# Altium schematic sheet Micromouse.SchDoc
size A1; SheetNumber: 1; SheetTotal: 1
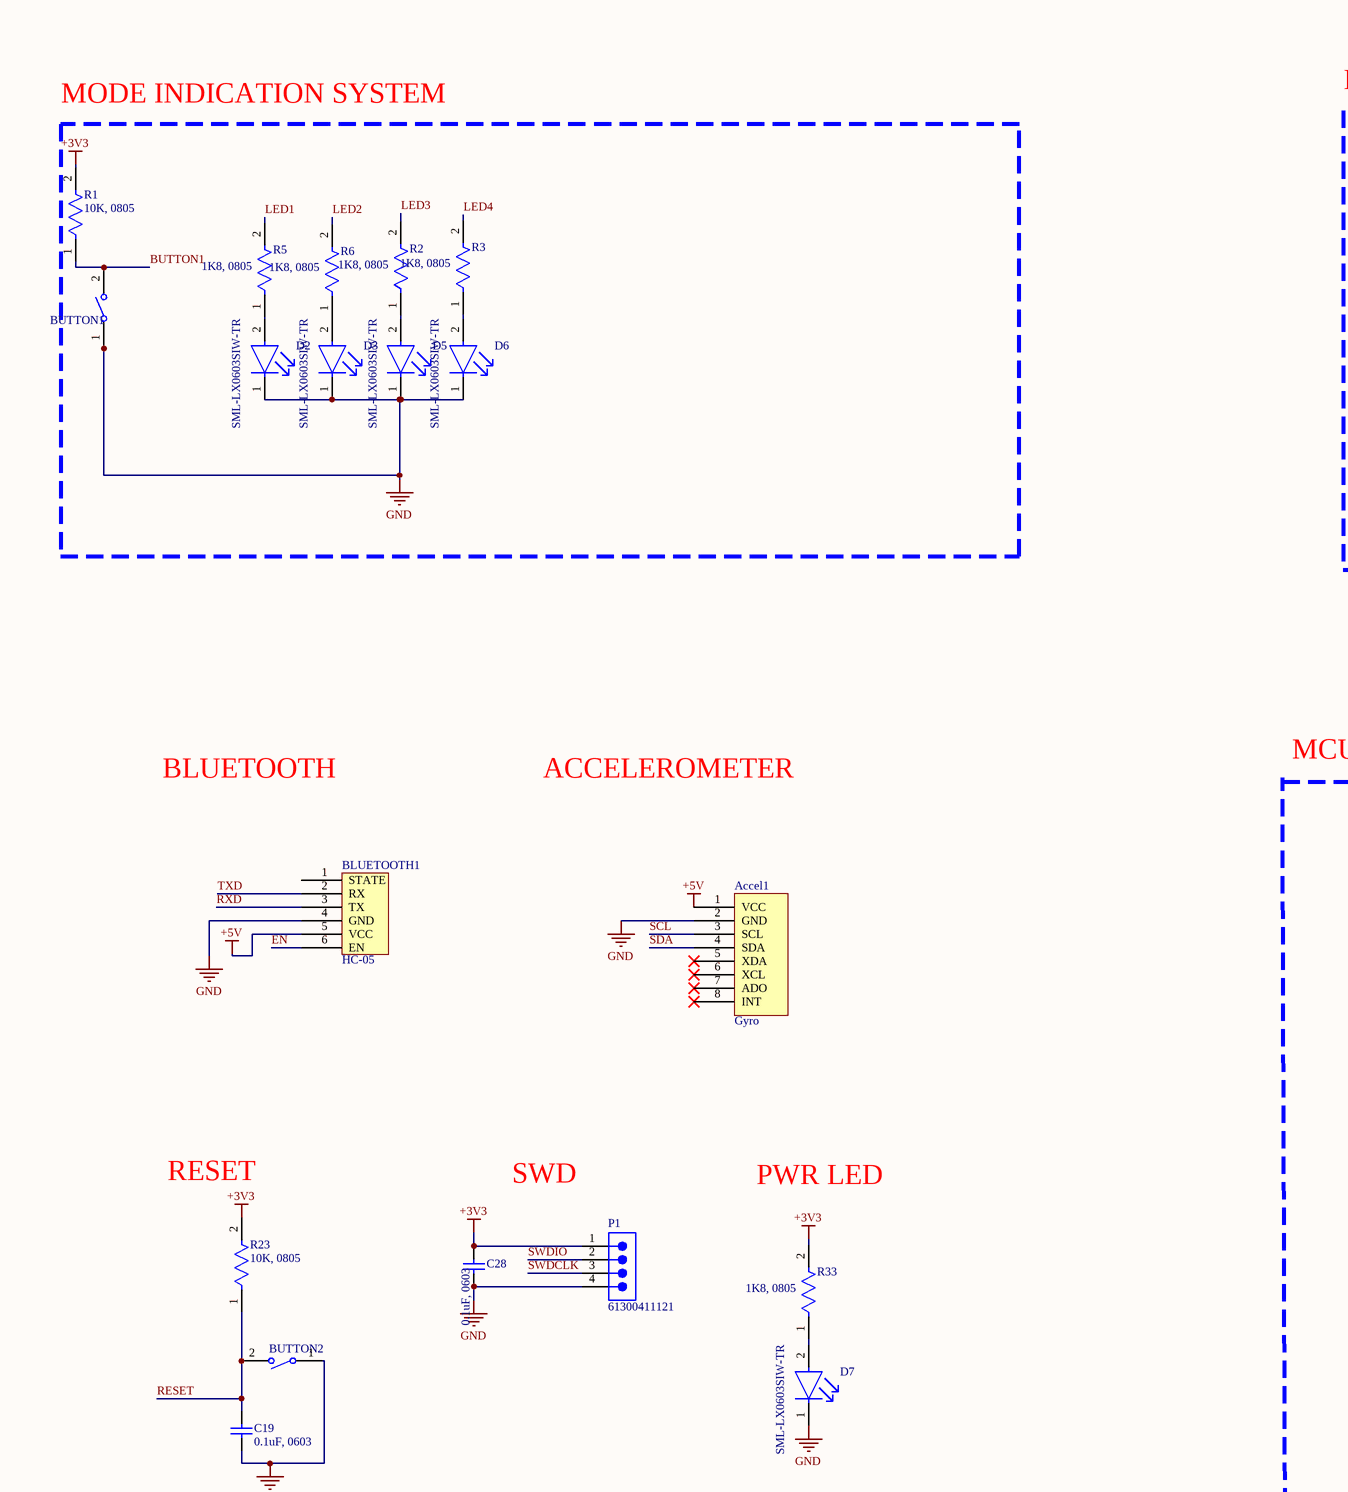
[diagram p0: Micromouse.SchDoc, top left]
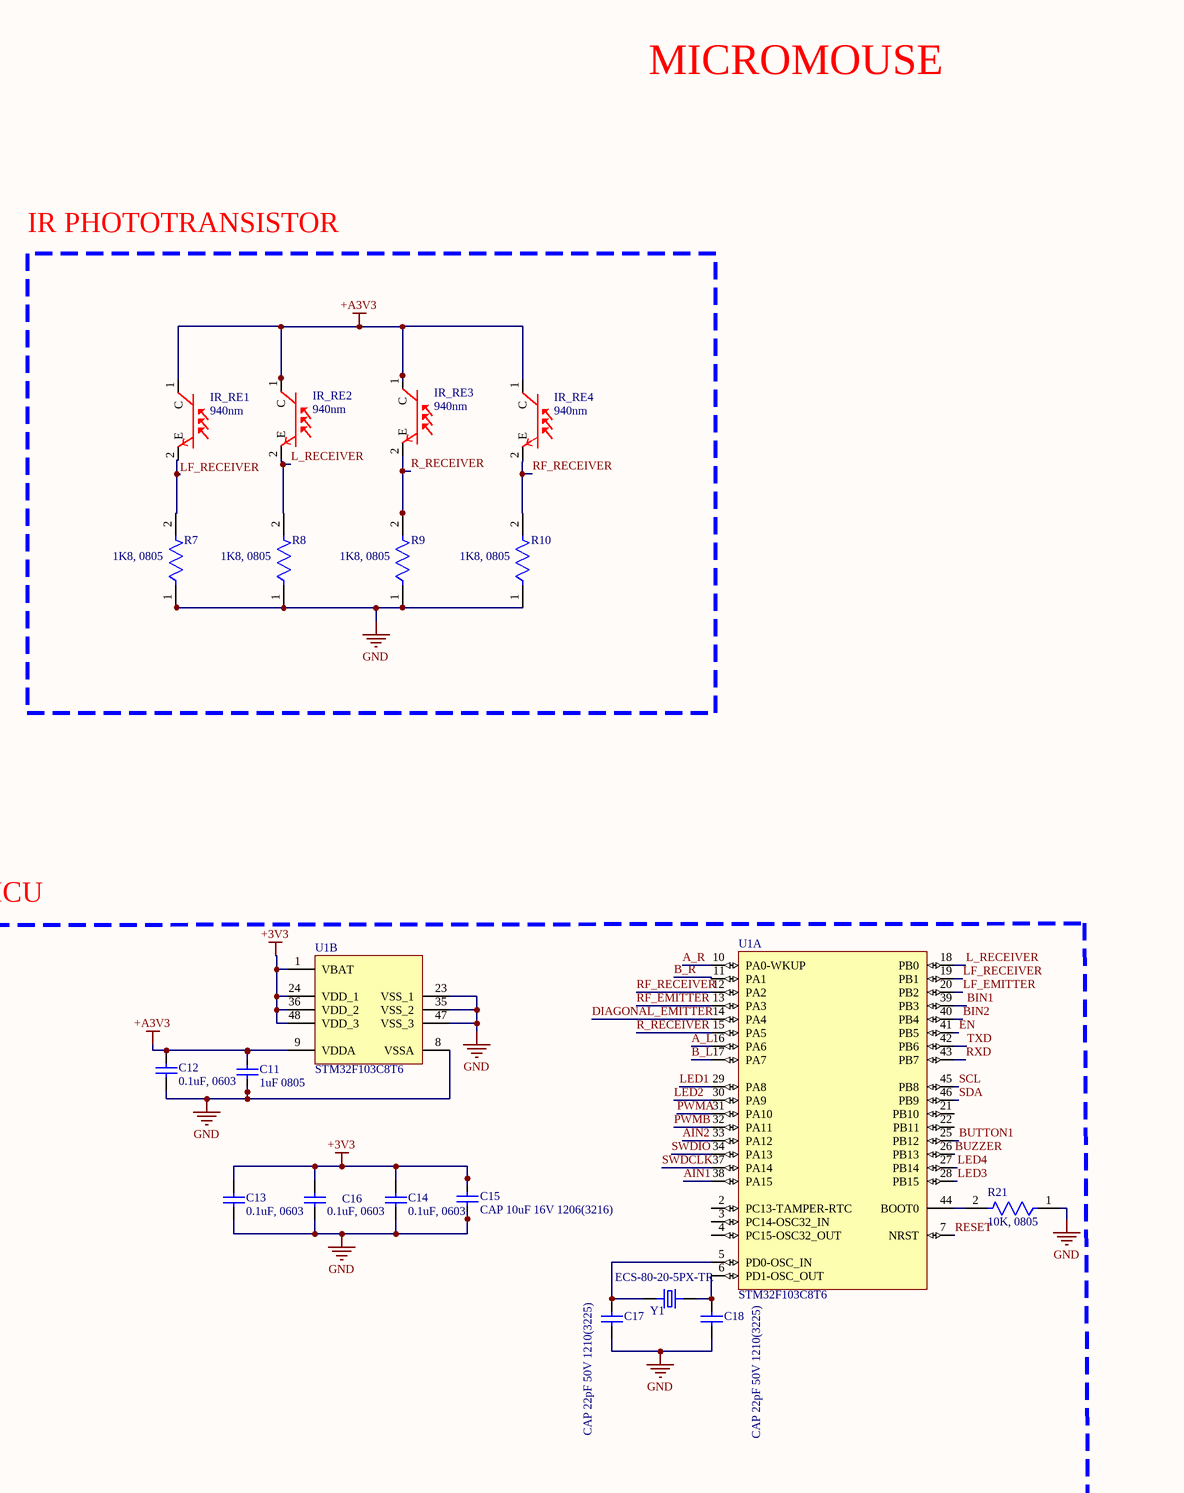
[diagram p1: Micromouse.SchDoc, top middle]
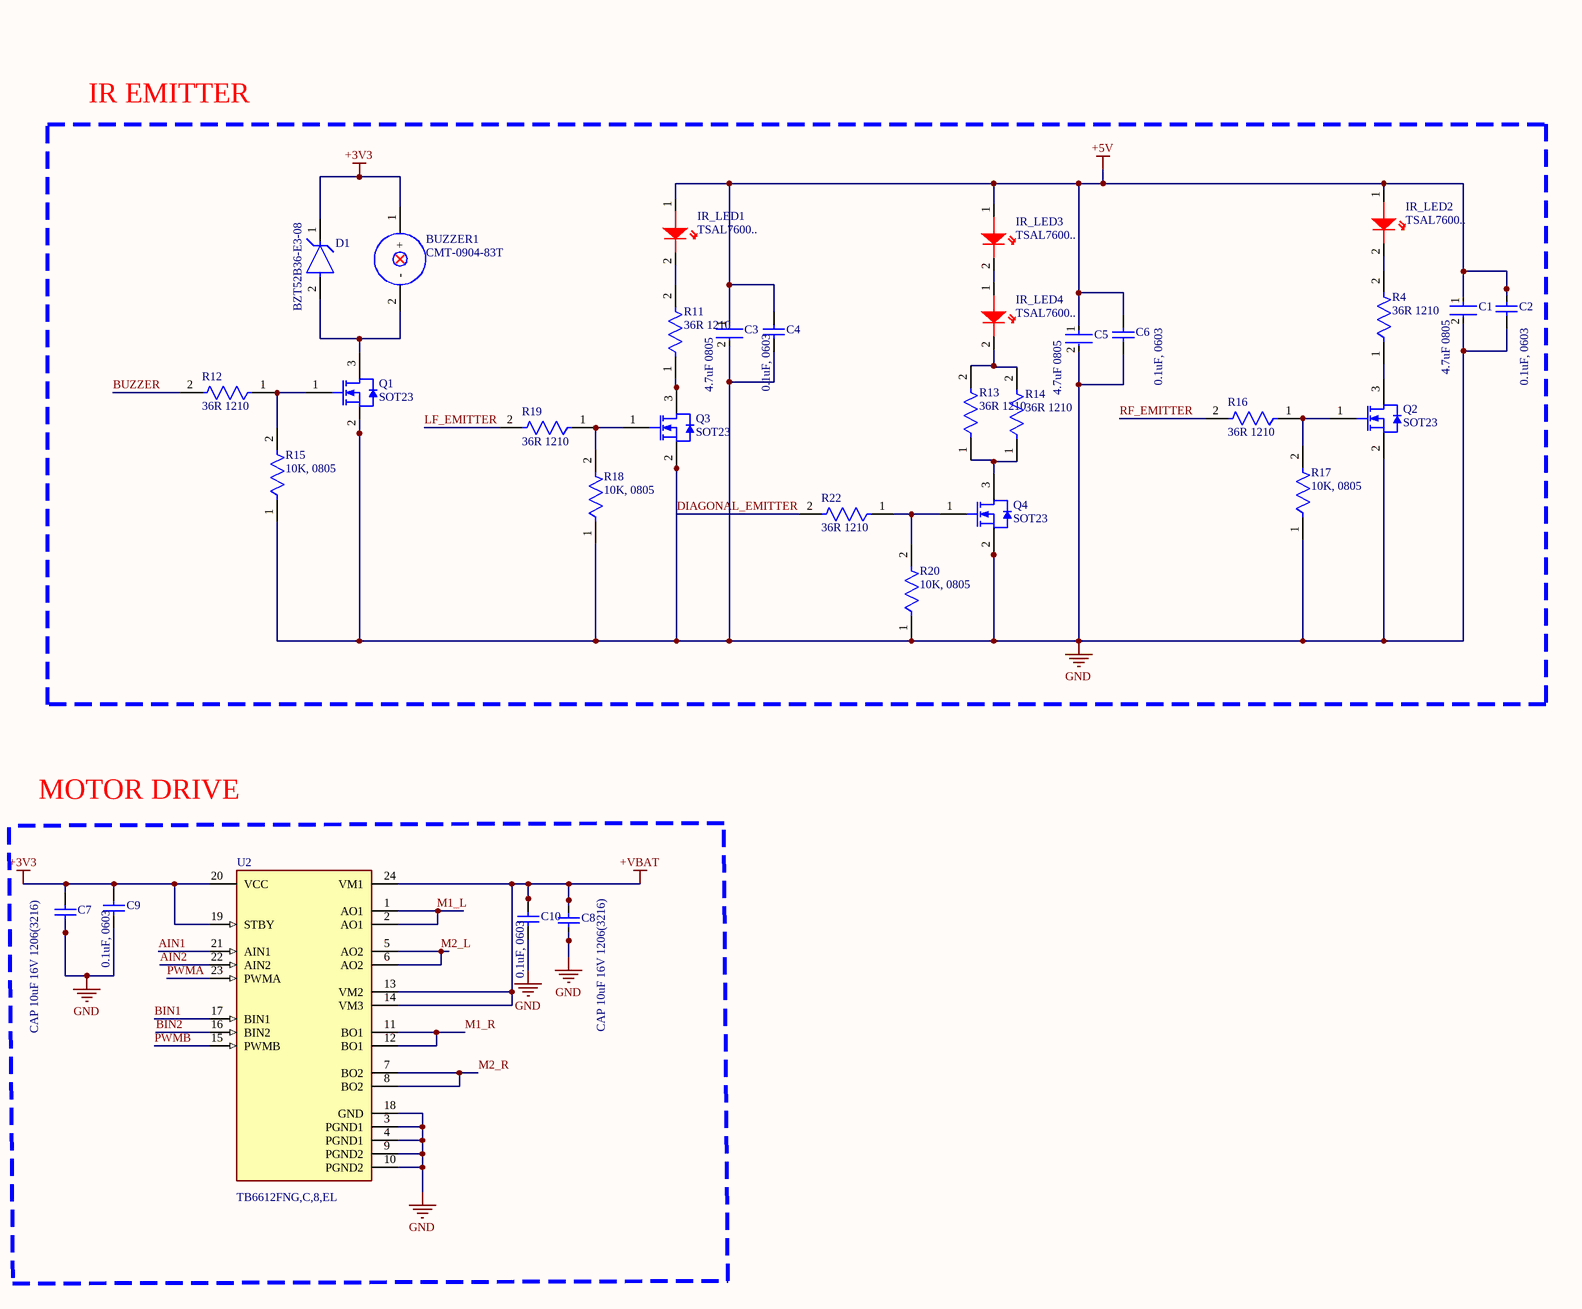
[diagram p2: Micromouse.SchDoc, top right]
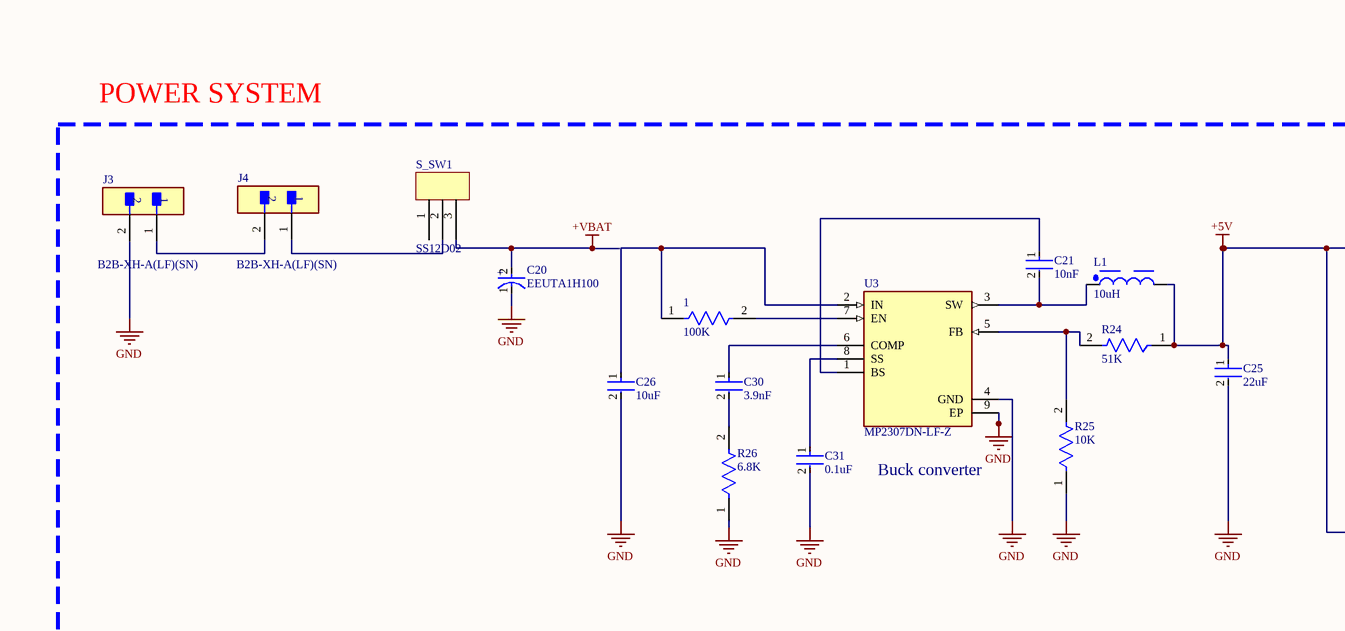
[diagram p3: Micromouse.SchDoc, bottom left]
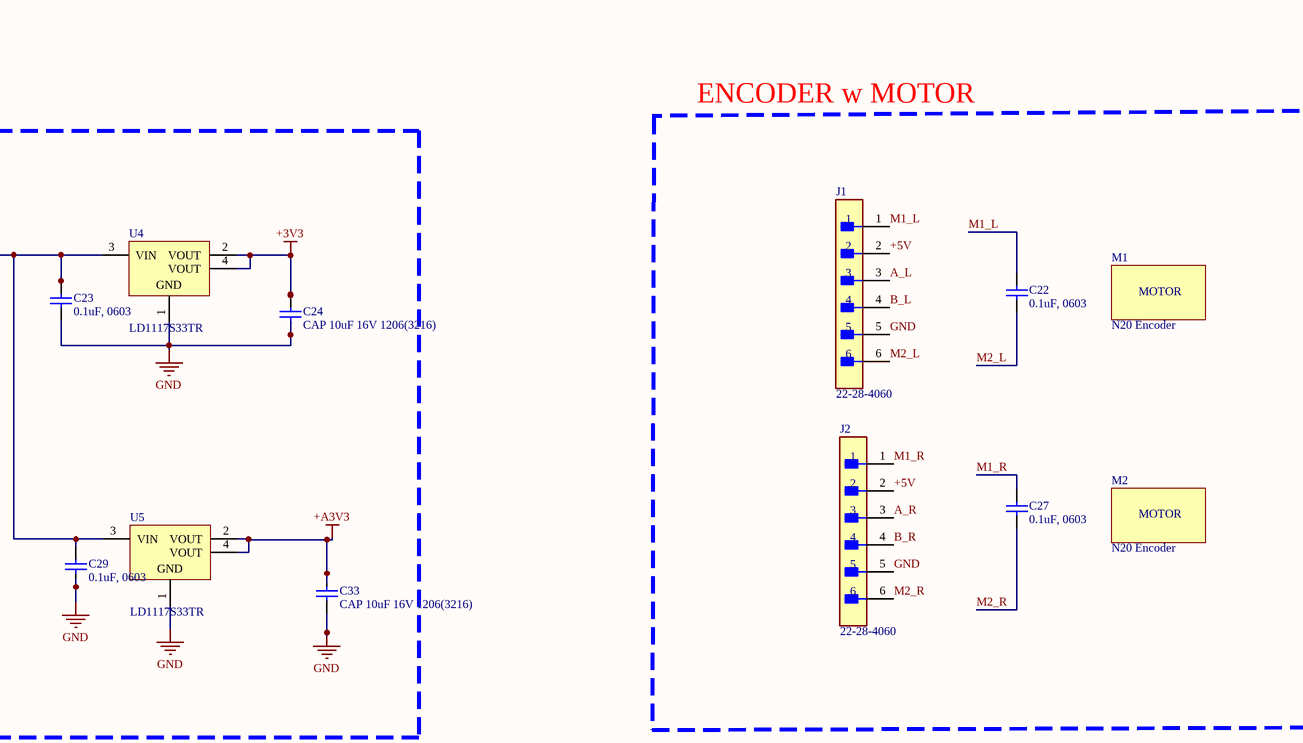
[diagram p4: Micromouse.SchDoc, bottom middle]
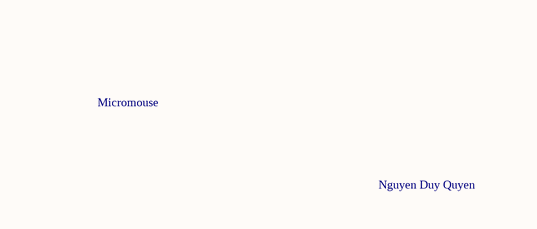
[diagram p5: Micromouse.SchDoc, bottom right]

## Parts
1  100K  [FP-CRCW0805-e3-IPC_B]
Accel1  Gyro  [Gyro]
BLUETOOTH1  HC-05  [HC-05]
BUTTON1  (no value)  [TECO-FSMSMTR_V]
BUTTON2  (no value)  [TECO-FSMSMTR_V]
BUZZER1  CMT-0904-83T  [BUZZER]
C1  4.7uF 0805  [FP-CC0805-0_85-MFG]
C2  0.1uF, 0603  [CAPC1608X92X38NL15T08]
C3  4.7uF 0805  [FP-CC0805-0_85-MFG]
C4  0.1uF, 0603  [CAPC1608X92X38NL15T08]
C5  4.7uF 0805  [FP-CC0805-0_85-MFG]
C6  0.1uF, 0603  [CAPC1608X92X38NL15T08]
C7  CAP 10uF 16V 1206(3216)  [CAPC1206(3216)190_L]
C8  CAP 10uF 16V 1206(3216)  [CAPC1206(3216)190_L]
C9  0.1uF, 0603  [CAPC1608X92X38NL15T08]
C10  0.1uF, 0603  [CAPC1608X92X38NL15T08]
C11  1uF 0805  [CAPC2013X145X50NL20T20]
C12  0.1uF, 0603  [CAPC1608X92X38NL15T08]
C13  0.1uF, 0603  [CAPC1608X92X38NL15T08]
C14  0.1uF, 0603  [CAPC1608X92X38NL15T08]
C15  CAP 10uF 16V 1206(3216)  [CAPC1206(3216)190_L]
C16  0.1uF, 0603  [CAPC1608X92X38NL15T08]
C17  CAP 22pF 50V 1210(3225)  [CAPC1210(3225)100_N]
C18  CAP 22pF 50V 1210(3225)  [CAPC1210(3225)100_N]
C19  0.1uF, 0603  [CAPC1608X92X38NL15T08]
C20  EEUTA1H100  [FP-RAD-TH-D_8_0_5-L_11_5-MFG]
C21  10nF  [FP-C1206C-EB-MFG]
C22  0.1uF, 0603  [CAPC1608X92X38NL15T08]
C23  0.1uF, 0603  [CAPC1608X92X38NL15T08]
C24  CAP 10uF 16V 1206(3216)  [CAPC1206(3216)190_L]
C25  22uF  [FP-C1206C-EB-MFG]
C26  10uF  [FP-C1206C-EB-MFG]
C27  0.1uF, 0603  [CAPC1608X92X38NL15T08]
C28  0.1uF, 0603  [CAPC1608X92X38NL15T08]
C29  0.1uF, 0603  [CAPC1608X92X38NL15T08]
C30  3.9nF  [FP-C1206C-EB-MFG]
C31  0.1uF  [FP-C1206C-EB-MFG]
C33  CAP 10uF 16V 1206(3216)  [CAPC1206(3216)190_L]
D1  BZT52B36-E3-08  [FP-S8-V-3910_01-001-IPC_C]
D2  SML-LX0603SIW-TR  [FP-SML-LX0603SIW-TR-MFG]
D3  SML-LX0603SIW-TR  [FP-SML-LX0603SIW-TR-MFG]
D5  SML-LX0603SIW-TR  [FP-SML-LX0603SIW-TR-MFG]
D6  SML-LX0603SIW-TR  [FP-SML-LX0603SIW-TR-MFG]
D7  SML-LX0603SIW-TR  [FP-SML-LX0603SIW-TR-MFG]
IR_LED1  TSAL7600..  [IR LED]
IR_LED2  TSAL7600..  [IR LED]
IR_LED3  TSAL7600..  [IR LED]
IR_LED4  TSAL7600..  [IR LED]
IR_RE1  940nm  [IR_RE]
IR_RE2  940nm  [IR_RE]
IR_RE3  940nm  [IR_RE]
IR_RE4  940nm  [IR_RE]
J1  22-28-4060  [FP-22-28-4060-MFG]
J2  22-28-4060  [FP-22-28-4060-MFG]
J3  B2B-XH-A(LF)(SN)  [FP-B2B-XH-A_LF_SN-MFG]
J4  B2B-XH-A(LF)(SN)  [FP-B2B-XH-A_LF_SN-MFG]
L1  10uH  [WE-TPC_5818]
M1  N20 Encoder  [N20 Encoder]
M2  N20 Encoder  [N20 Encoder]
P1  61300411121  [61300411121]
Q1  SOT23  [FAIR-SSOT3L-3_V]
Q2  SOT23  [FAIR-SSOT3L-3_V]
Q3  SOT23  [FAIR-SSOT3L-3_V]
Q4  SOT23  [FAIR-SSOT3L-3_V]
R1  10K, 0805  [FP-CRGP0805-IPC_C]
R2  1K8, 0805  [FP-CRCW0805-e3-IPC_A]
R3  1K8, 0805  [FP-CRCW0805-e3-IPC_A]
R4  36R 1210  [FP-ESR25-IPC_A]
R5  1K8, 0805  [FP-CRCW0805-e3-IPC_A]
R6  1K8, 0805  [FP-CRCW0805-e3-IPC_A]
R7  1K8, 0805  [FP-CRCW0805-e3-IPC_A]
R8  1K8, 0805  [FP-CRCW0805-e3-IPC_A]
R9  1K8, 0805  [FP-CRCW0805-e3-IPC_A]
R10  1K8, 0805  [FP-CRCW0805-e3-IPC_A]
R11  36R 1210  [FP-ESR25-IPC_A]
R12  36R 1210  [FP-ESR25-IPC_A]
R13  36R 1210  [FP-ESR25-IPC_A]
R14  36R 1210  [FP-ESR25-IPC_A]
R15  10K, 0805  [FP-CRGP0805-IPC_C]
R16  36R 1210  [FP-ESR25-IPC_A]
R17  10K, 0805  [FP-CRGP0805-IPC_C]
R18  10K, 0805  [FP-CRGP0805-IPC_C]
R19  36R 1210  [FP-ESR25-IPC_A]
R20  10K, 0805  [FP-CRGP0805-IPC_C]
R21  10K, 0805  [FP-CRGP0805-IPC_C]
R22  36R 1210  [FP-ESR25-IPC_A]
R23  10K, 0805  [FP-CRGP0805-IPC_C]
R24  51K  [FP-CRCW0805-e3-IPC_B]
R25  10K  [FP-CRCW0805-e3-IPC_B]
R26  6.8K  [FP-CRCW0805-e3-IPC_B]
R33  1K8, 0805  [FP-CRCW0805-e3-IPC_A]
S_SW1  SS12D02  [S_SW?]
U1  STM32F103C8T6  [STM-LQFP48_L]  (parts A,B of 2)
U2  TB6612FNG,C,8,EL  [FP-SSOP24-P-300-0_65A-IPC_A]
U3  MP2307DN-LF-Z  [SOIC127P600X170-9N]
U4  LD1117S33TR  [SOT-223_L]
U5  LD1117S33TR  [SOT-223_L]
Y1  ECS-80-20-5PX-TR  [XTAL_ECS-80-20-5PX-TR]

## Blocks framed on the sheet
MODE INDICATION SYSTEM: BUTTON1 D2 D3 D5 D6 R1-R3 R5 R6
IR PHOTOTRANSISTOR: IR_RE1-IR_RE4 R7-R10
IR EMITTER: BUZZER1 C1-C6 D1 IR_LED1-IR_LED4 Q1-Q4 R4 R11-R20 R22
MOTOR DRIVE: C7-C10 U2
POWER SYSTEM: 1 C20 C21 C23-C26 C29-C31 C33 J3 J4 L1 R24-R26 S_SW1 U3-U5
ENCODER w MOTOR: C22 C27 J1 J2 M1 M2

## Nets
+3V3: BUZZER1.1(+) C7.2 C9.2 C13.2 C14.2 C15.2 C16.2 C24.2 C28.2 D1.1(C) P1.1 R1.2 R23.2 R33.2 U1.1(VBAT) U1.24(VDD_1) U1.36(VDD_2) U1.48(VDD_3) U2.19(STBY) U2.20(VCC) U4.2(VOUT) U4.4(VOUT)
+5V: Accel1.1(VCC) BLUETOOTH1.5(VCC) C1.1 C2.2 C3.1 C4.2 C5.1 C6.2 C23.2 C25.1 C29.2 IR_LED1.1(A) IR_LED2.1(A) IR_LED3.1(A) J1.2 J2.2 L1.2 R24.1 U4.3(VIN) U5.3(VIN)
+A3V3: C11.2 C12.2 C33.2 IR_RE1.1(C) IR_RE2.1(C) IR_RE3.1(C) IR_RE4.1(C) U1.9(VDDA) U5.2(VOUT) U5.4(VOUT)
+VBAT: C8.2 C10.2 C20.2(A) S_SW1.3 U2.13(VM2) U2.14(VM3) U2.24(VM1)
DIAGONAL_EMITTER: Accel1.2(GND) BLUETOOTH1.4(GND) BUTTON1.1 BUTTON2.1 C1.2 C2.1 C3.2 C4.1 C5.2 C6.1 C7.1 C8.1 C9.1 C10.1 C11.1 C12.1 C13.1 C14.1 C15.1 C16.1 C17.1 C18.1 C19.1 C20.1(C) C23.1 C24.1 C25.2 C26.2 C28.1 C29.1 C31.2 C33.1 D2.1(C) D3.1(C) D5.1(C) D6.1(C) D7.1(C) J1.5 J2.5 J3.2 P1.4 Q1.2(S) Q2.2(S) Q3.2(S) Q4.2(S) R7.1 R8.1 R9.1 R10.1 R15.1 R17.1 R18.1 R20.1 R21.1 R22.2 R25.1 R26.1 U1.8(VSSA) U1.14(PA4) U1.23(VSS_1) U1.35(VSS_2) U1.47(VSS_3) U2.3(PGND1) U2.4(PGND1) U2.9(PGND2) U2.10(PGND2) U2.18(GND) U3.4(GND) U3.9(EP) U4.1(GND) U5.1(GND)  [also labelled GND]
A_L: J1.3 U1.16(PA6)
A_R: J2.3 U1.10(PA0-WKUP)
AIN1: U1.38(PA15) U2.21(AIN1)
AIN2: U1.33(PA12) U2.22(AIN2)
B_L: J1.4 U1.17(PA7)
B_R: J2.4 U1.11(PA1)
BIN1: U1.39(PB3) U2.17(BIN1)
BIN2: U1.40(PB4) U2.16(BIN2)
BUTTON1: BUTTON1.2 R1.1 U1.25(PB12)
BUZZER: R12.2 U1.26(PB13)
EN: BLUETOOTH1.6(EN) U1.41(PB5)
L_RECEIVER: IR_RE2.2(E) R8.2 U1.18(PB0)
LED1: R5.2 U1.29(PA8)
LED2: R6.2 U1.30(PA9)
LED3: R2.2 U1.28(PB15)
LED4: R3.2 U1.27(PB14)
LF_EMITTER: R19.2 U1.20(PB2)
LF_RECEIVER: IR_RE1.2(E) R7.2 U1.19(PB1)
M1_L: C22.2 J1.1 U2.1(AO1) U2.2(AO1)
M1_R: C27.2 J2.1 U2.11(BO1) U2.12(BO1)
M2_L: C22.1 J1.6 U2.5(AO2) U2.6(AO2)
M2_R: C27.1 J2.6 U2.7(BO2) U2.8(BO2)
PWMA: U1.31(PA10) U2.23(PWMA)
PWMB: U1.32(PA11) U2.15(PWMB)
R_RECEIVER: IR_RE3.2(E) R9.2 U1.15(PA5)
RESET: BUTTON2.2 C19.2 R23.1 U1.7(NRST)
RF_EMITTER: R16.2 U1.13(PA3)
RF_RECEIVER: IR_RE4.2(E) R10.2 U1.12(PA2)
RXD: BLUETOOTH1.3(TX) U1.43(PB7)
SCL: Accel1.3(SCL) U1.45(PB8)
SDA: Accel1.4(SDA) U1.46(PB9)
SWDCLK: P1.3 U1.37(PA14)
SWDIO: P1.2 U1.34(PA13)
TXD: BLUETOOTH1.2(RX) U1.42(PB6)
Net1_1: 1.1 C26.1 U3.2(IN)
Net1_2: 1.2 U3.7(EN)
NetBUZZER1_2: BUZZER1.2(-) D1.2(A) Q1.3(D)
NetC17_2: C17.2 U1.5(PD0-OSC_IN) Y1.1
NetC18_2: C18.2 U1.6(PD1-OSC_OUT) Y1.2
NetC21_1: C21.1 U3.1(BS)
NetC21_2: C21.2 L1.1 U3.3(SW)
NetC30_1: C30.1 U3.6(COMP)
NetC30_2: C30.2 R26.2
NetC31_1: C31.1 U3.8(SS)
NetD2_2: D2.2(A) R5.1
NetD3_2: D3.2(A) R6.1
NetD5_2: D5.2(A) R2.1
NetD6_2: D6.2(A) R3.1
NetD7_2: D7.2(A) R33.1
NetIR_LED1_2: IR_LED1.2(K) R11.2
NetIR_LED2_2: IR_LED2.2(K) R4.2
NetIR_LED3_2: IR_LED3.2(K) IR_LED4.1(A)
NetIR_LED4_2: IR_LED4.2(K) R13.2 R14.2
NetJ3_1: J3.1 J4.2
NetJ4_1: J4.1 S_SW1.2
NetQ1_1: Q1.1(G) R12.1 R15.2
NetQ2_1: Q2.1(G) R16.1 R17.2
NetQ2_3: Q2.3(D) R4.1
NetQ3_1: Q3.1(G) R18.2 R19.1
NetQ3_3: Q3.3(D) R11.1
NetQ4_1: Q4.1(G) R20.2 R22.1
NetQ4_3: Q4.3(D) R13.1 R14.1
NetR21_2: R21.2 U1.44(BOOT0)
NetR24_2: R24.2 R25.2 U3.5(FB)

Not connected (* = marked no-connect by the designer): Accel1 5(XDA)* 6(XCL)* 7(ADO)* 8(INT)*; BLUETOOTH1 1(STATE); S_SW1 1; U1 2(PC13-TAMPER-RTC) 3(PC14-OSC32_IN) 4(PC15-OSC32_OUT) 21(PB10) 22(PB11)

## Notes on the sheet
- MICROMOUSE
- BLUETOOTH
- ACCELEROMETER
- MCU
- RESET
- SWD
- PWR LED
- Buck converter
- Micromouse
- Nguyen Duy Quyen
- (in symbol CMP-05427-000566-1) +
- (in symbol N20 Encoder) MOTOR

## Library data of the parts
1 R24-R26 = CMP-02407-004732-1: RES Thick Film, 2.49Ω, 1%, 0.125W, 200ppm/°C, 0805; Voltage Rating: 150V; Resistance: 2.49R; Max Power Dissipation: 125mW; Max Operating Temperature: 155°C; Tolerance: 1%; Termination: SMD/SMT; Packaging: Tape and Reel; Height: 0.02inch; Case Code (Imperial): 0805; Radiation Hardening: No; Width: 1.25mm; Voltage Rating (DC): 150V; Number of Terminations: 2; Lead Free: Lead Free; Features: Automotive AEC-Q200; Power Rating: 125mW; Case/Package: 0805; Length: 0.079inch; Contact Plating: Tin; Composition: Thick Film; Weight: 0.000194oz; Package Quantity: 5000; Min Operating Temperature: -55°C; Case Code (Metric): 2012; Temperature Coefficient: 200ppm/°C
BUTTON1 BUTTON2 = CMP-2000-07501-1: FSMSM Push Button Switch, 50 mA, -35 to 85 degC, 2-Pin SMD, RoHS, Tape and Reel; Manufacturer: TE Connectivity; Voltage Rating (DC): 24V; Electrical Life: 20000Cycles; Operating Force: 180gf; Switch Travel: 0.25mm; Contact Current Rating: 50mA; Case\/Package: SMD/SMT; Actuator Length: 1.07mm; Throw Configuration: SPST; Actuator Material: Polyamide; Contact Resistance: 100mOhm; Illumination Type: Illuminated; Max Voltage Rating (DC): 12V; Manufacturer URL: http://www.te.com/; Lead Free: LeadFree; Packaging: TapeandReel; Min Operating Temperature: -35degC; Mechanical Life: 20000Cycles; Mount: SurfaceMount; REACH SVHC: Unknown; Package Quantity: 1800; Package Reference: FSMSMTR; RoHSCompliant: true; Max Operating Temperature: 85degC; Orientation: Straight; ELV: Compliant; Datasheet URL: http://www.te.com/commerce/DocumentDelivery/DDEController?Action=showdoc&DocId=Customer+Drawing%7F1437566-3%7FC2%7Fpdf%7FEnglish%7FENG_CD_1437566-3_C2_1437566_3_1_c.dwg.pdf%7F1437566-4; Package Description: 2-Pin Surface Mount Device, Body 6 x 3.5 mm, Pitch 9.19 mm; Current Rating: 50mA; Contact Plating: Silver; Termination: GullWing; Datasheet Version: Rev. C2, 08/2014; Contact Material: Brass; Mounting Technology: SurfaceMount
BUZZER1 = CMT-0904-83T: 9 mm, 3 Vo-p, 83 dB, Through Hole, Magnetic Audio Transducer Buzzer; Manufacturer: Same Sky; Shape: Round; Voltage Rating: 3V; Supplier 1: DigiKey; Manufacturer Part Number: CMT-0904-83T; RoHS: Compliant; Category: Buzzers; Stock 1: 1208; Pricing 1: 1=0.85, 10=0.692, 25=0.6376, 50=0.5994, 150=0.54367, 300=0.51123, 600=0.48083, 1050=0.45769, 5100=0.4125 (USD); Height: 4mm; Length: 9mm; Lifecycle Status: Production; Mount: Through Hole; REACH SVHC: Yes; Width: 9mm; ComponentLink1URL: https://datasheet.octopart.com:443/CMT-0904-83T-Same-Sky-datasheet-188822697.pdf?src-supplier=Same+Sky; ComponentLink1Description: https://datasheet.octopart.com:443/CMT-0904-83T-Same-Sky-datasheet-188822697.pdf?src-supplier=Same+Sky; ComponentLink2URL: https://datasheet.octopart.com:443/CMT-0904-83T-Same-Sky-datasheet-181915096.pdf?src-supplier=Same+Sky; ComponentLink2Description: https://datasheet.octopart.com:443/CMT-0904-83T-Same-Sky-datasheet-181915096.pdf?src-supplier=Same+Sky; ComponentLink3URL: https://datasheet.octopart.com:443/CMT-0904-83T-CUI-Devices-datasheet-175924030.pdf?src-supplier=Same+Sky; ComponentLink3Description: https://datasheet.octopart.com:443/CMT-0904-83T-CUI-Devices-datasheet-175924030.pdf?src-supplier=Same+Sky; ComponentLink4URL: https://datasheet.octopart.com:443/CMT-0904-83T-CUI-Devices-datasheet-137938165.pdf?src-supplier=Same+Sky; ComponentLink4Description: https://datasheet.octopart.com:443/CMT-0904-83T-CUI-Devices-datasheet-137938165.pdf?src-supplier=Same+Sky; ComponentLink5URL: https://datasheet.octopart.com:443/CMT-0904-83T-Same-Sky-datasheet-182879906.pdf?src-supplier=Electro+Sonic; ComponentLink5Description: https://datasheet.octopart.com:443/CMT-0904-83T-Same-Sky-datasheet-182879906.pdf?src-supplier=Electro+Sonic; ComponentLink6URL: https://datasheet.octopart.com:443/CMT-0904-83T-CUI-Devices-datasheet-175926246.pdf?src-supplier=Electro+Sonic; ComponentLink6Description: https://datasheet.octopart.com:443/CMT-0904-83T-CUI-Devices-datasheet-175926246.pdf?src-supplier=Electro+Sonic; ComponentLink7URL: https://datasheet.octopart.com:443/CMT-0904-83T-CUI-Devices-datasheet-142081241.pdf?src-supplier=Electro+Sonic; ComponentLink7Description: https://datasheet.octopart.com:443/CMT-0904-83T-CUI-Devices-datasheet-142081241.pdf?src-supplier=Electro+Sonic; ComponentLink8URL: https://datasheet.octopart.com:443/CMT-0904-83T-Same-Sky-datasheet-189104592.pdf?src-supplier=Master+Electronics; ComponentLink8Description: https://datasheet.octopart.com:443/CMT-0904-83T-Same-Sky-datasheet-189104592.pdf?src-supplier=Master+Electronics; ComponentLink9URL: https://datasheet.octopart.com:443/CMT-0904-83T-Same-Sky-datasheet-188930384.pdf?src-supplier=TME; ComponentLink9Description: https://datasheet.octopart.com:443/CMT-0904-83T-Same-Sky-datasheet-188930384.pdf?src-supplier=TME; ComponentLink10URL: https://datasheet.octopart.com:443/CMT-0904-83T-CUI-Devices-datasheet-175926986.pdf?src-supplier=CUI+Devices+SCT; ComponentLink10Description: https://datasheet.octopart.com:443/CMT-0904-83T-CUI-Devices-datasheet-175926986.pdf?src-supplier=CUI+Devices+SCT; ComponentLink11URL: https://datasheet.octopart.com:443/CMT-0904-83T-CUI-Devices-datasheet-142348057.pdf?src-supplier=CUI+Devices+SCT; ComponentLink11Description: https://datasheet.octopart.com:443/CMT-0904-83T-CUI-Devices-datasheet-142348057.pdf?src-supplier=CUI+Devices+SCT; ComponentLink12URL: https://octopart.com:443/opatz8j6/c1?t=BfVticT8k_04HtN3y7WnlebFNTVyeOKR_Qt-tZl4Cj1g5idAi0bmQN77aQVxhSZsDTUxEF116V8CClgZTHInHgpLYjMQ3DhtTQO0KOo5fuzzZs8TR6X05YkOk9bQSe-J0J4oggQou-2Jgf4six7RfGvfy2Q5VALErM6zBPwhCbtQ6qUITRaXOh9qaIWrDSZE3MjwIpbJikm3zhaoqK8nfCAADfzkXx5refF6kWcG68-69d6kL5Qu6y7Q9ZRzA5yousEdOdW8xDwpoaIb9ezJa1Bvw3ByNRubme9iySmOYF7sq8InDXJ1olcrz7n5Lm9Thc-E1Sepc158atY_ovnVruezXgrzK3c59Q&src-supplier=Compliance+Statements; ComponentLink12Description: https://octopart.com:443/opatz8j6/c1?t=BfVticT8k_04HtN3y7WnlebFNTVyeOKR_Qt-tZl4Cj1g5idAi0bmQN77aQVxhSZsDTUxEF116V8CClgZTHInHgpLYjMQ3DhtTQO0KOo5fuzzZs8TR6X05YkOk9bQSe-J0J4oggQou-2Jgf4six7RfGvfy2Q5VALErM6zBPwhCbtQ6qUITRaXOh9qaIWrDSZE3MjwIpbJikm3zhaoqK8nfCAADfzkXx5refF6kWcG68-69d6kL5Qu6y7Q9ZRzA5yousEdOdW8xDwpoaIb9ezJa1Bvw3ByNRubme9iySmOYF7sq8InDXJ1olcrz7n5Lm9Thc-E1Sepc158atY_ovnVruezXgrzK3c59Q&src-supplier=Compliance+Statements; ComponentLink13URL: https://octopart.com:443/opatz8j6/c1?t=80k0PqtJZBk5CzJUxsT2Qu5F_SdmX8gT_WkZjEzcgtrvO3cv1FcqA3ZNzkcZ4WNPXpl6vhcrJX3V_bxZ5KEo0QcsSnmPu12oJoXhhtrNZHAbCZLwRa1OdhfynrUwgNJCYjtIN7uzO4pso5u8tVqGvkl6WcaKNI_4IkWGdVmO2EjoqtQfdaY4riskjVfX-lu-hYcI7VRjBuWaWDvu_-O9UDaO7feMr_yDGfJhNUB1LK_Lg_rwuybEDeIna_HcCms46k_FAmLosUHo0QYBP1pLBlC9R-AC1PkuiPYZoAER8kgkL9VJ6IMVsgUzsmwqc4lKnCMEDNuBrJ4SVlPBcZJPDzMhBJDUFpref72yETQ&src-supplier=Compliance+Statements; ComponentLink13Description: https://octopart.com:443/opatz8j6/c1?t=80k0PqtJZBk5CzJUxsT2Qu5F_SdmX8gT_WkZjEzcgtrvO3cv1FcqA3ZNzkcZ4WNPXpl6vhcrJX3V_bxZ5KEo0QcsSnmPu12oJoXhhtrNZHAbCZLwRa1OdhfynrUwgNJCYjtIN7uzO4pso5u8tVqGvkl6WcaKNI_4IkWGdVmO2EjoqtQfdaY4riskjVfX-lu-hYcI7VRjBuWaWDvu_-O9UDaO7feMr_yDGfJhNUB1LK_Lg_rwuybEDeIna_HcCms46k_FAmLosUHo0QYBP1pLBlC9R-AC1PkuiPYZoAER8kgkL9VJ6IMVsgUzsmwqc4lKnCMEDNuBrJ4SVlPBcZJPDzMhBJDUFpref72yETQ&src-supplier=Compliance+Statements; ComponentLink14URL: https://octopart.com:443/opatz8j6/c1?t=hqJmcgxcx_KzRC61hUheiJHxIDeH2Fz5Bl2AiZjJjPnLyjnTY4H2va9iDFqneT_2gorDmLhrWOF6f2ZFTk1oauyRAqYXiMLSPkaPXo0GoL0YB9nYAjStlDHFUcdUPvgLJOxoBC5_E2kaHKszF1XDrSqwFzXQR9IVVZ872F5gVhVVf-Uc2BmAHhfeUZtQTZOG3jxXqQd8Nt_n9vTCXfrh17BNqAiWnKKio69jJ54q5qL_-BUKYut1vn9DOjOSH5YZIpA7ZV3q8gLALOzVfRl7JwzlW7DkwpH7j899zCpy1UMjUFJgctIHYBJ6prfwwFiXivcy8ErlWxAUQMQv89A8ltrsw43BZpbdtA&src-supplier=Compliance+Statements; ComponentLink14Description: https://octopart.com:443/opatz8j6/c1?t=hqJmcgxcx_KzRC61hUheiJHxIDeH2Fz5Bl2AiZjJjPnLyjnTY4H2va9iDFqneT_2gorDmLhrWOF6f2ZFTk1oauyRAqYXiMLSPkaPXo0GoL0YB9nYAjStlDHFUcdUPvgLJOxoBC5_E2kaHKszF1XDrSqwFzXQR9IVVZ872F5gVhVVf-Uc2BmAHhfeUZtQTZOG3jxXqQd8Nt_n9vTCXfrh17BNqAiWnKKio69jJ54q5qL_-BUKYut1vn9DOjOSH5YZIpA7ZV3q8gLALOzVfRl7JwzlW7DkwpH7j899zCpy1UMjUFJgctIHYBJ6prfwwFiXivcy8ErlWxAUQMQv89A8ltrsw43BZpbdtA&src-supplier=Compliance+Statements; ComponentLink15URL: https://octopart.com:443/opatz8j6/c1?t=w1X7Qv33hjSbRb4wCMsR08lVlhTdHcHeubErImXvSdEYc4diwdhRXjIaEeGFcVlC3HHIbC_7r5CIrM5kZmvZPLIiZCwtgxuH_Te537NwX8nDnZkPUkzKY0NcwU8pzM8rqeyEJ2lQbTLtBQyrILTEDGXy6f3LRyai5WtnxwYAFUyA2uyTGcWOEykgtp6Ym2st3SfSnEc9YBGEKuHroM0vm1_hIzTr9X53PXb0LQfPlJiva0I28AQcNB2zYsItjKw0cVm1ypcywyK7gLAE8Q0_Qk2CH96-KNn3V7W2Ngc0HxnRHTe-1nJIV1UICAqpi6SRSiNLBeW3SaxZPk2Z9SAYvNn2bZW4NOFOo3afwQY&src-supplier=Compliance+Statements; ComponentLink15Description: https://octopart.com:443/opatz8j6/c1?t=w1X7Qv33hjSbRb4wCMsR08lVlhTdHcHeubErImXvSdEYc4diwdhRXjIaEeGFcVlC3HHIbC_7r5CIrM5kZmvZPLIiZCwtgxuH_Te537NwX8nDnZkPUkzKY0NcwU8pzM8rqeyEJ2lQbTLtBQyrILTEDGXy6f3LRyai5WtnxwYAFUyA2uyTGcWOEykgtp6Ym2st3SfSnEc9YBGEKuHroM0vm1_hIzTr9X53PXb0LQfPlJiva0I28AQcNB2zYsItjKw0cVm1ypcywyK7gLAE8Q0_Qk2CH96-KNn3V7W2Ngc0HxnRHTe-1nJIV1UICAqpi6SRSiNLBeW3SaxZPk2Z9SAYvNn2bZW4NOFOo3afwQY&src-supplier=Compliance+Statements; Supplier Part Number 1: 102-CMT-0904-83T-ND
C1 C3 C5 = CMP-03422-000207-1: CAP CER 4.7UF 16V X7R 0805; Manufacturer: Yageo; Manufacturer Part Number: CC0805KKX7R7BB475; Tolerance: 0.1; Material: Ceramic; Footprint Url: http://www.yageo.com/exep/pages/download/literatures/UPY-C_GEN_24.pdf; Device Class L3: Ceramic Capacitors; Temperature: -30°C to +85°C; Device Class L2: Capacitors; Automotive: No; Digikey Description: CAP CER 4.7UF 16V X7R 0805; Temperature Range High: +85°C; Lead Free: Yes; Mouser Description: Multilayer Ceramic Capacitors MLCC - SMD/SMT 4.7M pF 10% 16 Volts; Temperature Characteristic: X7R; Height: 0.95mm; Device Class L1: Passive Components; ComponentLink2Description: Datasheet; Category: Cap; Octopart: https://octopart.com/cc0805kkx7r7bb475-yageo-34429188; Temperature Range Low: -30°C; Package: CC0805-0.85; Ipc Land Pattern Name: CAPC200125X85; RoHS: TRUE; Value: 4.7 uF; Capacitance: 4.7 uF; ComponentLink2URL: http://www.yageo.com/documents/recent/UPY-GPHC_Y5V_6.3V-to-50V_8.pdf; Voltage Rating: 16 V
C2 C4 C6 C9 C10 C12-C14 C16 C19 C22 C23 C27-C29 = CMP-2006-01166-1: Manufacturer: Vitramon; Part Number: VJ0603Y104KXXAP
C7 C8 C15 C24 C33 = CMP-1037-04978-1: CAP 10uF 16V -20% to +80% 1206 (3216 Metric) Thickness 1.9mm SMD; Case-EIA: 1206; Case-Metric: 3216; Tolerance: -20% to +80%; Technology: SMT; Value: 10uF; Rated Voltage: 16 V; Max Thickness: 1.9 mm
C11 = CMP-2007-01676-1: Part Number: VJ0805Y105KXQRW1BC; Manufacturer: Vitramon
C17 C18 = CMP-1038-00063-1: CAP 22pF 50V ±5% 1210 (3225 Metric) Thickness 1mm SMD; Case-EIA: 1210; Tolerance: Â±5%; Case-Metric: 3225; Value: 22pF; Max Thickness: 1 mm; Rated Voltage: 50 V; Technology: SMT
C20 = CMP-05427-000566-1: Aluminum Electrolytic Capacitors (Radial Lead Type) AEC-Q200 Qualified 10uF ±20% 50V; Impedance: 950mR; Life (Hours): 2000Hour; Ripple Current: 180mA; Lead Diameter: 0.6mm; Package Quantity: 200; Capacitance: 10uF; Max Operating Temperature: 125°C; Diameter: 8mm; Height - Seated (Max): 0.492inch; Construction: RADIAL; Voltage Rating (DC): 50V; RoHS Compliant: Yes; Length: 11.5mm; Voltage Rating: 50V; Series: TA; Termination: Radial; Height: 11.5mm; Mount: Through Hole; Min Operating Temperature: -40°C; Case/Package: Radial; Number of Pins: 2; Tolerance: 20%; REACH SVHC: No SVHC; Packaging: Bulk; Lead Pitch: 3.5mm; ESR (Equivalent Series Resistance): 950mR; Radiation Hardening: No
C21 C25 C31 = CMP-1037-00646-2: C1206 10 pF C0G 5.00% 50 V; Manufacturer Part Number: C1206C100J5GAC; Manufacturer: KEMET; Material: Ceramic; Automotive Grade: Grade 0; Voltage Rating: 50 V; Value: 10 pF; Temperature Coefficient: 15%; Tolerance: 0.05; Temperature: -55°C to +150°C; ComponentLink2URL: https://content.kemet.com/datasheets/KEM_C1007_X8R_ULTRA_150C_SMD.pdf; RoHS: TRUE; Lead Free: Yes; Category: Cap; Package: C1206C-EB; Device Class L2: Capacitors; Device Class L1: Passive Components; ComponentLink2Description: Datasheet; Ipc Land Pattern Name: CAPC320160X78; Device Class L3: Ceramic Capacitors; Temperature Characteristic: C0G; Octopart: https://octopart.com/c1206c100j5gac-kemet-1357555; Automotive: Yes; Height: 0.88mm; Temperature Range High: +150°C; Mouser Description: Multilayer Ceramic Capacitors MLCC - SMD/SMT 50volts 10pF 5% C0G; Temperature Range Low: -55°C; Capacitance: 10 pF
C26 = CMP-1037-00646-2: C1206 10 uF C0G 5.00% 50 V; Manufacturer Part Number: C1206C100J5GAC; Manufacturer: KEMET; Material: Ceramic; Automotive Grade: Grade 0; Voltage Rating: 50 V; Value: 10 pF; Temperature Coefficient: 15%; Tolerance: 0.05; Temperature: -55°C to +150°C; ComponentLink2URL: https://content.kemet.com/datasheets/KEM_C1007_X8R_ULTRA_150C_SMD.pdf; RoHS: TRUE; Lead Free: Yes; Category: Cap; Package: C1206C-EB; Device Class L2: Capacitors; Device Class L1: Passive Components; ComponentLink2Description: Datasheet; Ipc Land Pattern Name: CAPC320160X78; Device Class L3: Ceramic Capacitors; Temperature Characteristic: C0G; Octopart: https://octopart.com/c1206c100j5gac-kemet-1357555; Automotive: Yes; Height: 0.88mm; Temperature Range High: +150°C; Mouser Description: Multilayer Ceramic Capacitors MLCC - SMD/SMT 50volts 10pF 5% C0G; Temperature Range Low: -55°C; Capacitance: 10 pF
C30 = CMP-1037-00646-2: C1206 4.8nF C0G 5.00% 50 V; Manufacturer Part Number: C1206C100J5GAC; Manufacturer: KEMET; Material: Ceramic; Automotive Grade: Grade 0; Voltage Rating: 50 V; Value: 10 pF; Temperature Coefficient: 15%; Tolerance: 0.05; Temperature: -55°C to +150°C; ComponentLink2URL: https://content.kemet.com/datasheets/KEM_C1007_X8R_ULTRA_150C_SMD.pdf; RoHS: TRUE; Lead Free: Yes; Category: Cap; Package: C1206C-EB; Device Class L2: Capacitors; Device Class L1: Passive Components; ComponentLink2Description: Datasheet; Ipc Land Pattern Name: CAPC320160X78; Device Class L3: Ceramic Capacitors; Temperature Characteristic: C0G; Octopart: https://octopart.com/c1206c100j5gac-kemet-1357555; Automotive: Yes; Height: 0.88mm; Temperature Range High: +150°C; Mouser Description: Multilayer Ceramic Capacitors MLCC - SMD/SMT 50volts 10pF 5% C0G; Temperature Range Low: -55°C; Capacitance: 10 pF
D1 = CMP-02541-000029-1: DIODE ZENER 36V 410MW SOD123; Zener Current: 9mA; Power Dissipation: 500mW; Element Configuration: Single; Impedance: 40R; Max Reverse Leakage Current: 100nA; Tolerance: 2%; Zener Voltage: 36V; Min Operating Temperature: -55°C; Mount: Surface Mount; Max Operating Temperature: 150°C; Series: -; Number of Pins: 2; Package Quantity: 3000; Max Power Dissipation: 410mW; Packaging: Tape and Reel; RoHS Compliant: Yes; Voltage Tolerance: 2%
D2 D3 D5-D7 = CMP-57192-000009-1: LED RED DIFFUSED SMD; Test Current: 20mA; Forward Voltage: 2V; Approvals: UL; Dominant Wavelength: 636nm; Viewing Angle: 140°; Lens Color: White; Luminous Intensity: 60mcd; Power Rating: 50mW; Number of LEDs: 1; Color: Red; Forward Current: 20mA; Moisture Sensitivity Level: 2; Case Code (Imperial): 0603; Lead Free: Lead Free; Lens Transparency: Diffused; Case Code (Metric): 1608; Height: 0.6mm; Max Operating Temperature: 85°C; Width: 0.8mm; Lens Style: Diffused; Illumination Color: Red; Wavelength: 636nm; REACH SVHC: No SVHC; Package Quantity: 1; RoHS Compliant: Yes; Case/Package: 0603; Number of Pins: 2; Packaging: Tape and Reel; Length: 1.6mm; Mount: Surface Mount; Min Operating Temperature: -25°C
IR_LED1-IR_LED4 = TSAL7600..: 940 Nm, Gaalas/gaas, High Power Infrared Emitting Diode Infrared Led, 5MM, 1-ELEMENT, 940NM; Manufacturer: Vishay; Fall Time: 800ns; Forward Current: 100mA; Forward Voltage: 1.6V; Lens Style: Circular, Colorless, Diffused; Number of Circuits: 1; Output Power: 35mW; Power Rating: 210mW; Reverse Voltage: 5V; Shape: Round; Viewing Angle: 60°; Voltage Rating (DC): 2.6V; Supplier 1: Farnell; Manufacturer Part Number: TSAL7600..; RoHS: Compliant; Category: LEDs; Pricing 1: 10=0.235, 50=0.175, 250=0.119, 1000=0.105, 4000=0.078, 20000=0.0639, 40000=0.0575, 80000=0.0541 (GBP); Case/Package: Radial; Color: Clear; Depth: 5.8mm; Lead Free: Lead Free; Length: 5.8mm; Lifecycle Status: Obsolete; Max Operating Temperature: 85°C; Min Operating Temperature: -55°C; Mount: PCB, Through Hole; Number of Elements: 1; Number of LEDs: 1; Number of Pins: 2; Operating Supply Voltage: 1.6V; Orientation: Top View; Peak Wavelength: 940nm; Radiation Hardening: No; REACH SVHC: Unknown; Rise Time: 800ns; Test Current: 100mA; Wavelength: 940nm; ComponentLink1URL: https://datasheet.octopart.com:443/TSAL7600-Vishay-datasheet-8640020.pdf?src-supplier=Newark; ComponentLink1Description: https://datasheet.octopart.com:443/TSAL7600-Vishay-datasheet-8640020.pdf?src-supplier=Newark; ComponentLink2URL: https://datasheet.octopart.com:443/TSAL7600-Vishay-datasheet-10207873.pdf?src-supplier=Newark; ComponentLink2Description: https://datasheet.octopart.com:443/TSAL7600-Vishay-datasheet-10207873.pdf?src-supplier=Newark; ComponentLink3URL: https://datasheet.octopart.com:443/TSAL7600-Vishay-datasheet-27697.pdf?src-supplier=Newark; ComponentLink3Description: https://datasheet.octopart.com:443/TSAL7600-Vishay-datasheet-27697.pdf?src-supplier=Newark; ComponentLink4URL: https://datasheet.octopart.com:443/TSAL7600-Vishay-datasheet-7630768.pdf?src-supplier=element14; ComponentLink4Description: https://datasheet.octopart.com:443/TSAL7600-Vishay-datasheet-7630768.pdf?src-supplier=element14; ComponentLink5URL: https://datasheet.octopart.com:443/TSAL7600..-Vishay-datasheet-5332027.pdf?src-supplier=Future+Electronics; ComponentLink5Description: https://datasheet.octopart.com:443/TSAL7600..-Vishay-datasheet-5332027.pdf?src-supplier=Future+Electronics; ComponentLink6URL: https://datasheet.octopart.com:443/TSAL7600-Vishay-datasheet-640326.pdf?src-supplier=Future+Electronics; ComponentLink6Description: https://datasheet.octopart.com:443/TSAL7600-Vishay-datasheet-640326.pdf?src-supplier=Future+Electronics; ComponentLink7URL: https://datasheet.octopart.com:443/TSAL7600-Vishay-Siliconix-datasheet-111016687.pdf?src-supplier=RS+(Formerly+Allied+Electronics); ComponentLink7Description: https://datasheet.octopart.com:443/TSAL7600-Vishay-Siliconix-datasheet-111016687.pdf?src-supplier=RS+(Formerly+Allied+Electronics); ComponentLink8URL: https://datasheet.octopart.com:443/TSAL7600-Vishay-datasheet-10864752.pdf?src-supplier=RS+(Formerly+Allied+Electronics); ComponentLink8Description: https://datasheet.octopart.com:443/TSAL7600-Vishay-datasheet-10864752.pdf?src-supplier=RS+(Formerly+Allied+Electronics); ComponentLink9URL: https://datasheet.octopart.com:443/TSAL7600-Vishay-datasheet-14190172.pdf?src-supplier=iiiC; ComponentLink9Description: https://datasheet.octopart.com:443/TSAL7600-Vishay-datasheet-14190172.pdf?src-supplier=iiiC; ComponentLink10URL: http://sigma.octopart.com:80/rohs_statement/Vishay-company-15.pdf?src-supplier=Compliance+Statements; ComponentLink10Description: http://sigma.octopart.com:80/rohs_statement/Vishay-company-15.pdf?src-supplier=Compliance+Statements; Supplier Part Number 1: 1779664
IR_RE1-IR_RE4 = PT333-3B: Phototransistor Chip Silicon 940nm 2-Pin T-1 3/4 / PHOTOTRANSISTOR 5MM BLACK RAD; Manufacturer: Everlight; Collector Emitter Breakdown Voltage: 30V; Collector Emitter Voltage (VCEO): 5V; Dark Current: 100nA; Lens Style: Domed; Max Collector Current: 20mA; Number of Circuits: 1; Polarity: NPN; Shape: Round; Supplier 1: DigiKey; Manufacturer Part Number: PT333-3B; RoHS: Compliant; Category: Linear ICs; Pricing 1: 1500=0.11261 (USD); Case/Package: Radial; China RoHS: Compliant; Lead Free: Lead Free; Lens Color: Black; Lifecycle Status: Production; Max Operating Temperature: 85°C; Min Operating Temperature: -25°C; Mount: Through Hole; Number of Pins: 2; Orientation: Top View; Packaging: Bulk; Peak Wavelength: 940nm; REACH SVHC: Yes; Wavelength: 940nm; ComponentLink1URL: https://datasheet.octopart.com:443/PT333-3B-Everlight-datasheet-157602376.pdf?src-supplier=IHS; ComponentLink1Description: https://datasheet.octopart.com:443/PT333-3B-Everlight-datasheet-157602376.pdf?src-supplier=IHS; ComponentLink2URL: https://datasheet.octopart.com:443/PT333-3B-Everlight-datasheet-188867738.pdf?src-supplier=TME; ComponentLink2Description: https://datasheet.octopart.com:443/PT333-3B-Everlight-datasheet-188867738.pdf?src-supplier=TME; ComponentLink3URL: https://datasheet.octopart.com:443/PT333-3B-Everlight-datasheet-188867740.pdf?src-supplier=TME; ComponentLink3Description: https://datasheet.octopart.com:443/PT333-3B-Everlight-datasheet-188867740.pdf?src-supplier=TME; ComponentLink4URL: https://datasheet.octopart.com:443/PT333-3B-Everlight-datasheet-188867739.pdf?src-supplier=TME; ComponentLink4Description: https://datasheet.octopart.com:443/PT333-3B-Everlight-datasheet-188867739.pdf?src-supplier=TME; ComponentLink5URL: https://datasheet.octopart.com:443/PT333-3B-Everlight-datasheet-65606424.pdf?src-supplier=Future+Electronics; ComponentLink5Description: https://datasheet.octopart.com:443/PT333-3B-Everlight-datasheet-65606424.pdf?src-supplier=Future+Electronics; Supplier Part Number 1: 1080-1156-ND
J1 J2 = CMP-04776-000763-1: CONN HEADER VERT 6POS 2.54MM; Voltage Rating: 250V; Current Rating: 4A; Number of Contacts: 6; Max Voltage Rating (DC): 250.25kV; Gender: Male; Contact Resistance: 20mR; Connector Type: Male Pin; Color: Black; Max Voltage Rating (AC): 250V; Pitch: 2.54mm; Orientation: Straight; Max Operating Temperature: 75°C; Contact Plating: Tin; Depth: 2.49mm; Contact Type: Male Pin; Number of Positions: 6; Length: 15.24mm; Packaging: Bulk; Mount: Through Hole; Housing Material: Thermoplastic; Housing Color: Black; Termination: Solder; Contact Material: Brass; Min Operating Temperature: 0°C; Series: KK® 42375; Number of Rows: 1; Package Quantity: 1; RoHS Compliant: Yes; Contact Mating Length: 0.24inch
J3 J4 = CMP-2000-05888-3: CONN HEADER VERT 2POS 2.5MM; Current Rating: 3A; Voltage Rating: 250V; Number of Contacts: 2; Contact Resistance: 20mR; Wire/Cable Gauge: 22AWG; Insulation Resistance: 1GR; Connector Type: Male Pin; Packaging: Bulk; Contact Material: Brass; Lead Free: Lead Free; Orientation: Straight; Contact Plating: Tin; Max Current Rating: 3A; Termination: Solder; Fastening Type: Detent; Depth: 5.75mm; Housing Material: Polyamide; REACH SVHC: No SVHC; Series: XH; Voltage Rating (AC): 250V; Number of Positions: 2; Color: Natural; Contact Type: Male Pin; Max Voltage Rating (DC): 250V; Pitch: 2.5mm; Lead Pitch: 2.5mm; Mount: Through Hole; Max Operating Temperature: 85°C; Length: 7.4mm; Max Voltage Rating (AC): 250V; Min Operating Temperature: -25°C; Number of Rows: 1; Housing Color: White
L1 = CMP-0227-00416-3: NexarPartId: 22866864; DC Resistance (DCR): 70mΩ; Current Rating: 1.45A; Test Frequency: 100kHz; Shielding: Shielded; Tolerance: 30%; Saturation Current: 1.6A; Core Material: Ferrite; Inductance: 6.2µH; Self Resonant Frequency: 45MHz; Case Code (Imperial): 2323; Weight: 248.001628mg; Ambient Temperature Range Low: -40°C; Height - Seated (Max): 2.0066mm; Ambient Temperature Range High: 95°C; Height: 1.8mm; Number of Pins: 2; Inductance Tolerance: 30%; Max DC Current: 1.45A; Min Operating Temperature: -40°C; Depth: 5.8mm; Composition: Wirewound; Case/Package: 2323; Case Code (Metric): 5858; Packaging: Cut Tape (CT); Termination: SMD/SMT; Length: 5.8mm; Mount: Surface Mount; REACH SVHC: Unknown; Max Operating Temperature: 125°C; RoHS: Compliant; RMS Current (Irms): 1.45A; Width: 5.8mm
P1 = CMP-1502-01064-3: NexarPartId: 32855522; Operating Supply Voltage: 250V; Pitch: 2.54mm; Contact Resistance: 20mΩ; Number of Positions: 4; Current Rating: 3A; Connector Type: Male Pin; Gender: Male; Contact Plating: Gold; Height: 8.89mm; Lead Pitch: 2.54mm; Lead Free: Lead Free; Contact Mating Length: 5.9944mm; Number of Rows: 1; Termination: Solder; Packaging: Bulk; REACH SVHC: Unknown; Min Operating Temperature: -40°C; RoHS: Compliant; Number of Contacts: 4; Voltage Rating: 250V; Color: Black; Max Operating Temperature: 105°C; Contact Material: Copper; Mount: Through Hole; Orientation: Vertical; Number of Pins: 4
Q1-Q4 = CMP-2000-06249-1: N-Channel Specified PowerTrench(R) MOSFET, 2.5 V, 1.7 A, -55 to 150 degC, 3-Pin SSOT3L, RoHS, Tape and Reel; Manufacturer: FairchildSemiconductor; RDS-on: 0.07@4.5VOhm; Typical Fall Time: 3ns; Maximum Drain Source Voltage: 20V; Rad Hard: No; Channel Mode: Enhancement; Package Version: Rev. 3, 05/2015; Maximum Gate Source Voltage: ±8V; Typical Rise Time: 8.5ns; Typical Turn-Off Delay Time: 11ns; Maximum Continuous Drain Current: 1.7A; Channel Type: N; Typical Turn-On Delay Time: 5ns; Packaging: Tape&Reel; Mounting Technology: SurfaceMount; Mounting: SurfaceMount; Manufacturer URL: https://www.fairchildsemi.com/; Datasheet URL: https://www.fairchildsemi.com/datasheets/FD/FDN335N.pdf; Package Description: 3-Pin Small Outline Transistor, Body 2.92 x 1.4 mm, Pitch 0.95 mm; Package URL: https://www.fairchildsemi.com/package-drawings/MA/MA03B.pdf; Datasheet Version: Rev. C, 04/1999; Package Reference: SSOT3L; Package: 3SuperSOT; Operating Temperature: -55to150°C; Category: MOSFET
R1 R15 R17 R18 R20 R21 R23 = CMP-03211-006861-1: CRGP 0805 10K 1%; Manufacturer Part Number: CRGP0805F10K; Manufacturer: TE; Power Rating: 0.33W; Voltage Rating: 150V; Value: 10KΩ; Tolerance: 0.01; Temperature Coefficient: ±100ppm/°C; ComponentLink2URL: https://www.mouser.com/datasheet/2/418/NG_DS_9-1773463-9_A-1358566.pdf; Temperature Range Low: -55°C; Ipc Land Pattern Name: RESC200125X55; Device Class L2: Resistors; Automotive: No; Device Class L3: Chip SMD Resistors; Composition: Thick Film; Temperature Range High: +155°C; Temperature: -55°C to +155°C; Height: 0.65mm; Series: CRGP; RoHS: TRUE; Device Class L1: Passive Components; Octopart: https://octopart.com/crgp0805f10k-te+connectivity-91018782; Package: CRGP0805; Digikey Description: CRGP 0805 10K 1%; Ambient Temperature Range High: +70°C; Lead Free: Yes; ComponentLink2Description: Datasheet; Category: Res; Resistance: 10KΩ
R2 R3 R5-R10 R33 = CMP-02407-002077-1: RES Thick Film, 1.8kΩ, 1%, 0.125W, 100ppm/°C, 0805; Power Rating: 125mW; Resistance: 1.8kR; Tolerance: 1%; Case/Package: 0805; Lead Free: Lead Free
R4 R11-R14 R16 R19 R22 = CMP-08839-001586-1: 36Ω ±1% 0.66W 1210 Anti-Surge Chip Resistor AEC-Q200; Max Power Dissipation: 500mW; Temperature Coefficient: 100ppm/°C; Width: 0.098inch; Length: 0.126inch; Resistance: 36R; Series: ESR25; Number of Terminations: 2; Tolerance: 1%; Packaging: Tape and Reel; RoHS Compliant: Yes; Max Operating Temperature: 155°C; Min Operating Temperature: -55°C; Package Quantity: 4000; Case/Package: 1210; Height: 0.026inch; Resistor Type: Thick Film
U1 = CMP-0237-00215-3: ARM Cortex-M3 32-bit MCU, 64 KB Flash, 20 KB Internal RAM, 37 I/Os, 48-pin LQFP, -40 to 85 degC, Tray; Supply Voltage(Vcc) min (V): 2; Internal RAM Size (kB): 20; FLASH Size (Prog) (kB): 64; A/D Converter: 2x12-bit (10 Channel); I/Os (High Current): 37; Operating Frequency(F) (Processor speed) (MHz): 72; Core: ARM Cortex-M3; ComponentLink3Description: Package Specification; Mounting Technology: Surface Mount; PartNumber: STM32F103C8T6; PackageReference: LQFP48; Packing: Tray; ComponentLink3URL: http://www.st.com/st-web-ui/static/active/en/resource/technical/document/datasheet/DM00058181.pdf; DatasheetVersion: Rev. 16; ComponentLink1URL: http://www.st.com/web/en/home.html; PackageVersion: Rev. 6, 06/2013; ComponentLink2URL: http://www.st.com/st-web-ui/static/active/en/resource/technical/document/datasheet/CD00161566.pdf; ComponentLink1Description: Manufacturer URL; ComponentLink2Description: Datasheet; PackageDescription: 48-Pin Low Profile Quad Flat Package, 7 x 7 mm Body, 0.5 mm Pitch
U2 = CMP-2100-03693-4: IC MOTOR DRIVER 2.7V-5.5V 24SSOP; Logic Function: AND GATE; Interface: Parallel; Operating Supply Voltage: 3V; Max Supply Voltage: 5.5V; Output Current: 1A; Min Supply Voltage: 2.7V; Number of Outputs: 2; Packaging: Tape and Reel; Mount: Surface Mount; Number of Pins: 24; Min Operating Temperature: -20°C; Case/Package: SSOP; Series: -; Max Operating Temperature: 85°C; Package Quantity: 1
U3 = MP2307DN-LF-Z: Buck Switching Regulator IC Positive Adjustable 0.925V 1 Output 3A 8-SOIC (0.154, 3.90mm Width) Exposed Pad; MF: Monolithic Power; Check_prices: https://www.snapeda.com/parts/MP2307DN-LF-Z/Monolithic+Power+Systems+Inc./view-part/?ref=eda; SnapEDA_Link: https://www.snapeda.com/parts/MP2307DN-LF-Z/Monolithic+Power+Systems+Inc./view-part/?ref=snap; Availability: In Stock; Value: *; Price: None; MP: MP2307DN-LF-Z; Package: SOIC-8 Monolithic Power; Purchase-URL: https://pricing.snapeda.com/search/part/MP2307DN-LF-Z/?ref=eda
U4 U5 = CMP-0244-00310-1: Fixed Low Drop Positive Voltage Regulator, 3.3V, 4-Pin SOT-223, Tape and Reel; ComponentLink2Description: Datasheet; PackageDescription: 4-Pin SOT-223 Package, 6.5 x 3.5 mm Body, 2.3 mm Pitch, 7 mm Lead Span; PackageVersion: 2010; ComponentLink2URL: http://www.st.com/internet/com/TECHNICAL_RESOURCES/TECHNICAL_LITERATURE/DATASHEET/CD00000544.pdf; PackageReference: SOT-223; DatasheetVersion: 1/11/2011; ComponentLink1Description: Manufacturer URL; ComponentLink1URL: http://www.st.com
Y1 = ECS-80-20-5PX-TR: Ú©Ø±ÛŒØ³ØªØ§Ù„ 20 Ù¾ÛŒÚ©ÙˆÙØ§Ø±Ø§Ø¯ 60 Ø§Ù‡Ù… HC-49/US Ø¨Ø§ ÙØ±Ú©Ø§Ù†Ø³ 8 Ù…Ú¯Ø§Ù‡Ø±ØªØ² Ùˆ Â±30ppm; MF: ECS Inc.; SnapEDA_Link: https://www.snapeda.com/parts/ECS-80-20-5PX-TR/ECS/view-part/?ref=snap; Package: CSM-7X-3L-5G3X-2 ECS; Value: *; MP: ECS-80-20-5PX-TR; Check_prices: https://www.snapeda.com/parts/ECS-80-20-5PX-TR/ECS/view-part/?ref=eda